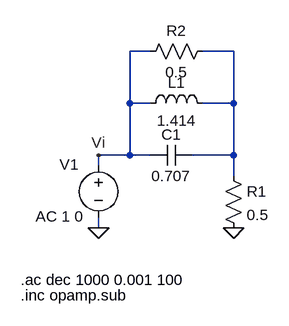
[diagram p0: schematic Bicuad_2B.asc]
Bicuad_2B.asc, the LTspice schematic file:
Version 4
SHEET 1 1328 680
WIRE 448 -176 416 -176
WIRE 576 -176 528 -176
WIRE 416 -96 416 -176
WIRE 448 -96 416 -96
WIRE 576 -96 576 -176
WIRE 576 -96 528 -96
WIRE 416 -16 416 -96
WIRE 416 -16 368 -16
WIRE 448 -16 416 -16
WIRE 576 -16 576 -96
WIRE 576 -16 512 -16
WIRE 368 0 368 -16
WIRE 576 16 576 -16
WIRE 368 96 368 80
FLAG 368 96 0
FLAG 368 -16 Vi
FLAG 576 96 0
SYMBOL voltage 368 -16 R0
WINDOW 123 -97 94 Left 2
WINDOW 39 0 0 Left 0
WINDOW 0 -60 14 Left 2
SYMATTR Value2 AC 1 0
SYMATTR InstName V1
SYMATTR Value ""
SYMBOL cap 512 -32 R90
WINDOW 0 0 32 VBottom 2
WINDOW 3 32 32 VTop 2
SYMATTR InstName C1
SYMATTR Value 0.707
SYMBOL ind 432 -80 R270
WINDOW 0 32 56 VTop 2
WINDOW 3 5 56 VBottom 2
SYMATTR InstName L1
SYMATTR Value 1.414
SYMBOL res 560 0 R0
SYMATTR InstName R1
SYMATTR Value 0.5
SYMBOL res 544 -192 R90
WINDOW 0 0 56 VBottom 2
WINDOW 3 32 56 VTop 2
SYMATTR InstName R2
SYMATTR Value 0.5
TEXT 248 200 Left 2 !.inc opamp.sub
TEXT 248 176 Left 2 !.ac dec 1000 0.001 100

The netlist it stands for:
* Bicuad_2B.asc
V1 Vi 0 AC 1 0
C1 N001 Vi 0.707
L1 Vi N001 1.414
R1 N001 0 0.5
R2 N001 Vi 0.5
.inc opamp.sub
.ac dec 1000 0.001 100
.backanno
.end